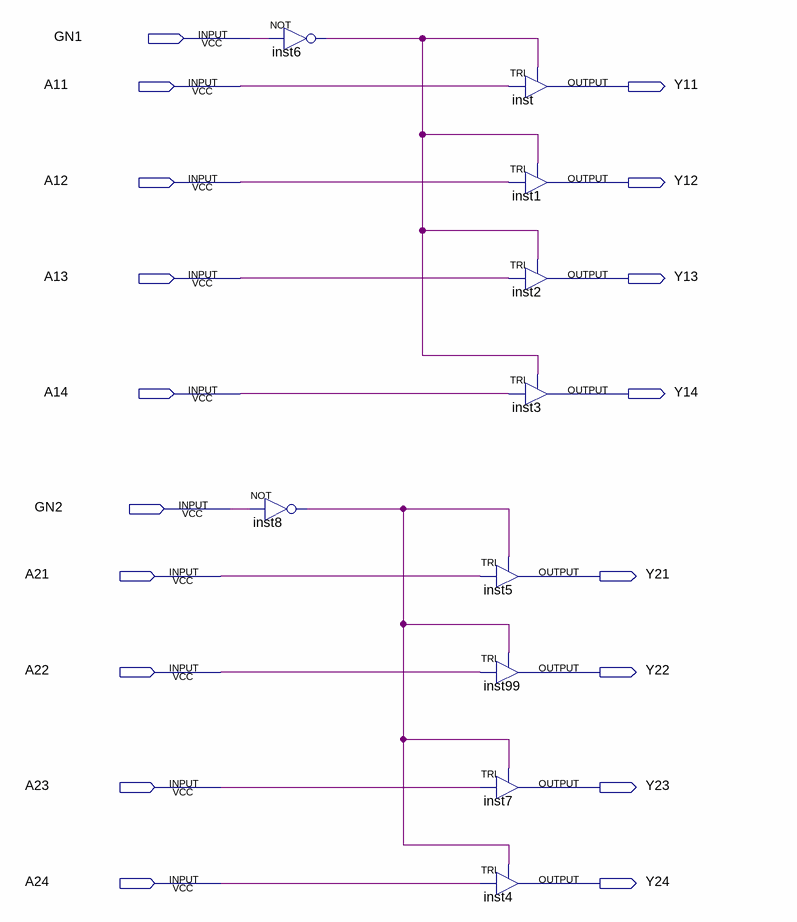
[diagram p0: schematic sheet]
// Quartus schematic CI74244_BUFFER_TRISTATE_UNIDIRECIONAL.bdf as structural Verilog: 10 symbols, 18 pins
module CI74244_BUFFER_TRISTATE_UNIDIRECIONAL (
  input  GN1,
  input  A11,
  input  A12,
  input  A13,
  input  A14,
  input  GN2,
  input  A21,
  input  A22,
  input  A23,
  input  A24,
  output Y11,
  output Y12,
  output Y13,
  output Y14,
  output Y21,
  output Y22,
  output Y23,
  output Y24
);

  wire inst6_out, inst8_out;

  not inst8 (inst8_out, GN2);
  not inst6 (inst6_out, GN1);
  TRI inst5 (.IN(A21), .OE(inst8_out), .OUT(Y21));
  TRI inst99 (.IN(A22), .OE(inst8_out), .OUT(Y22));
  TRI inst7 (.IN(A23), .OE(inst8_out), .OUT(Y23));
  TRI inst4 (.IN(A24), .OE(inst8_out), .OUT(Y24));
  TRI inst (.IN(A11), .OE(inst6_out), .OUT(Y11));
  TRI inst1 (.IN(A12), .OE(inst6_out), .OUT(Y12));
  TRI inst2 (.IN(A13), .OE(inst6_out), .OUT(Y13));
  TRI inst3 (.IN(A14), .OE(inst6_out), .OUT(Y14));
endmodule
